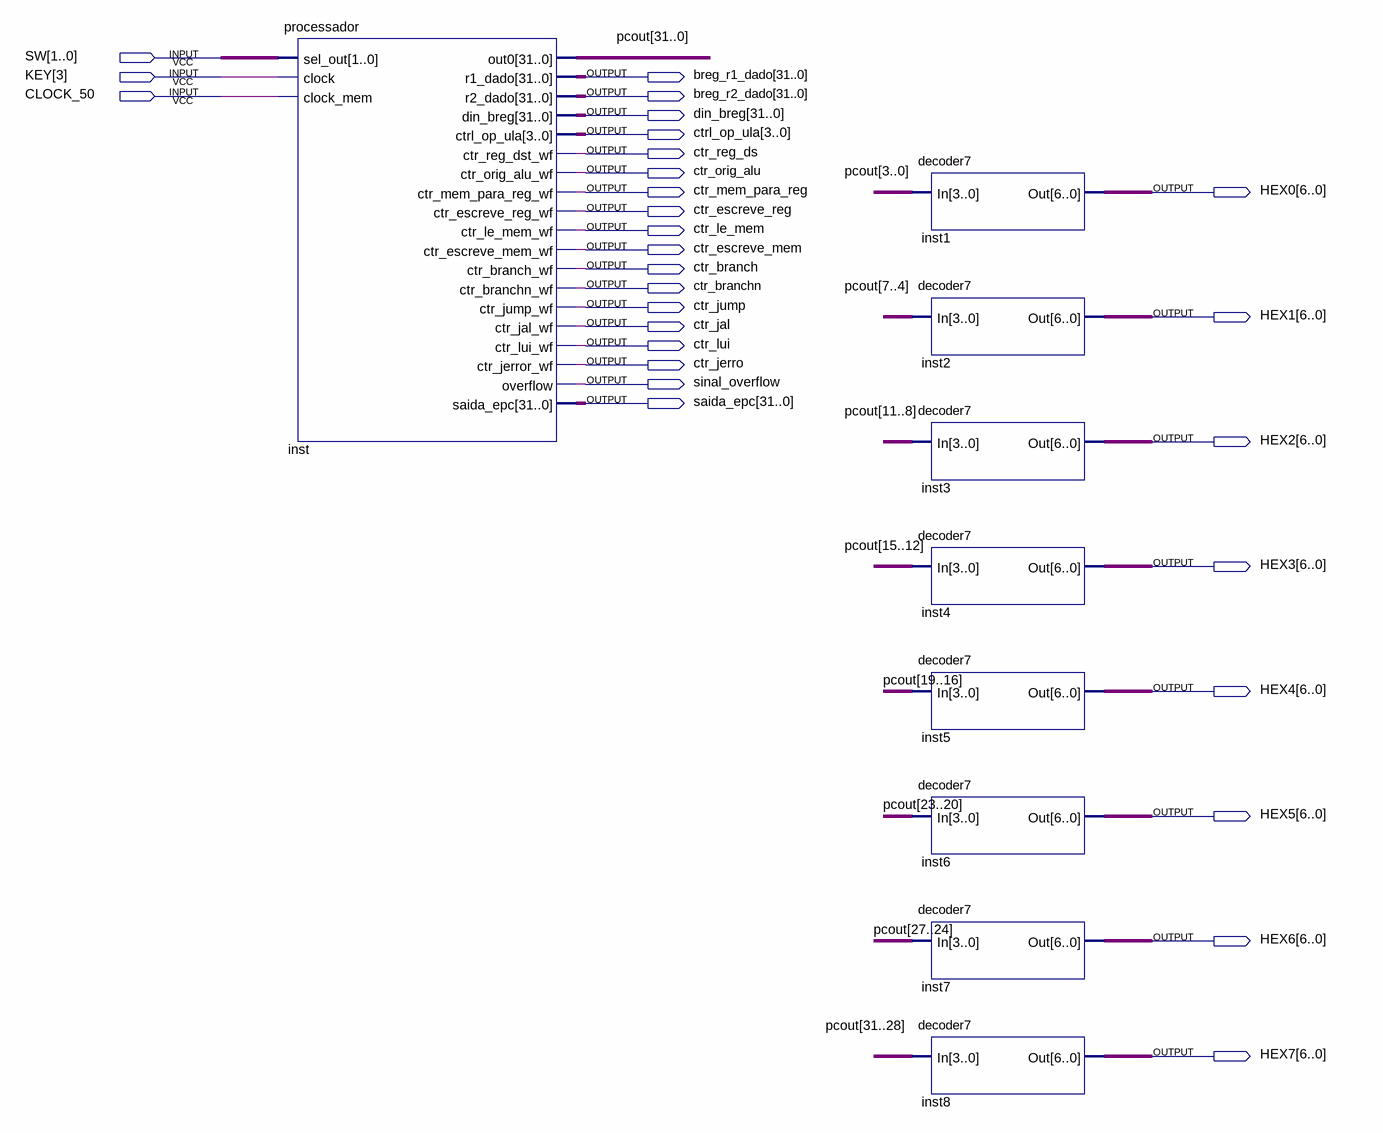
[diagram p0: schematic sheet]
// Quartus schematic Processador_mips_final.bdf as structural Verilog: 9 symbols, 29 pins
module Processador_mips_final (
  input  [1:0] SW,
  input  [3:3] KEY,
  input  CLOCK_50,
  output [31:0] breg_r1_dado,
  output [31:0] breg_r2_dado,
  output [31:0] din_breg,
  output [3:0] ctrl_op_ula,
  output ctr_reg_ds,
  output ctr_orig_alu,
  output ctr_mem_para_reg,
  output [6:0] HEX0,
  output ctr_escreve_reg,
  output ctr_le_mem,
  output ctr_escreve_mem,
  output ctr_branch,
  output ctr_branchn,
  output ctr_jump,
  output [6:0] HEX1,
  output ctr_jal,
  output ctr_lui,
  output ctr_jerro,
  output sinal_overflow,
  output [31:0] saida_epc,
  output [6:0] HEX2,
  output [6:0] HEX3,
  output [6:0] HEX4,
  output [6:0] HEX5,
  output [6:0] HEX6,
  output [6:0] HEX7
);

  wire [31:0] pcout;

  processador inst (
    .sel_out(SW), .clock(KEY[3]), .clock_mem(CLOCK_50), .out0(pcout), .r1_dado(breg_r1_dado),
    .r2_dado(breg_r2_dado), .din_breg(din_breg), .ctrl_op_ula(ctrl_op_ula), .ctr_reg_dst_wf(ctr_reg_ds),
    .ctr_orig_alu_wf(ctr_orig_alu), .ctr_mem_para_reg_wf(ctr_mem_para_reg),
    .ctr_escreve_reg_wf(ctr_escreve_reg), .ctr_le_mem_wf(ctr_le_mem), .ctr_escreve_mem_wf(ctr_escreve_mem),
    .ctr_branch_wf(ctr_branch), .ctr_branchn_wf(ctr_branchn), .ctr_jump_wf(ctr_jump), .ctr_jal_wf(ctr_jal),
    .ctr_lui_wf(ctr_lui), .ctr_jerror_wf(ctr_jerro), .overflow(sinal_overflow), .saida_epc(saida_epc));
  decoder7 inst1 (.In(pcout[3:0]), .Out(HEX0));
  decoder7 inst2 (.In(pcout[7:4]), .Out(HEX1));
  decoder7 inst3 (.In(pcout[11:8]), .Out(HEX2));
  decoder7 inst4 (.In(pcout[15:12]), .Out(HEX3));
  decoder7 inst5 (.In(pcout[19:16]), .Out(HEX4));
  decoder7 inst6 (.In(pcout[23:20]), .Out(HEX5));
  decoder7 inst7 (.In(pcout[27:24]), .Out(HEX6));
  decoder7 inst8 (.In(pcout[31:28]), .Out(HEX7));
endmodule
